# EasyEDA Pro project PicoDucky_V2.2.epro

# Schematic PicoDucky
Board Name: Board1; Create Date: 2026-04-21; Page Name: P1; Project Name: PicoDucky_V2.2(2mb); Schematic Name: PicoDucky; Update Date: 2026-04-21; Company: EasyEDA.com; Page Size: A4; Version: V1.0
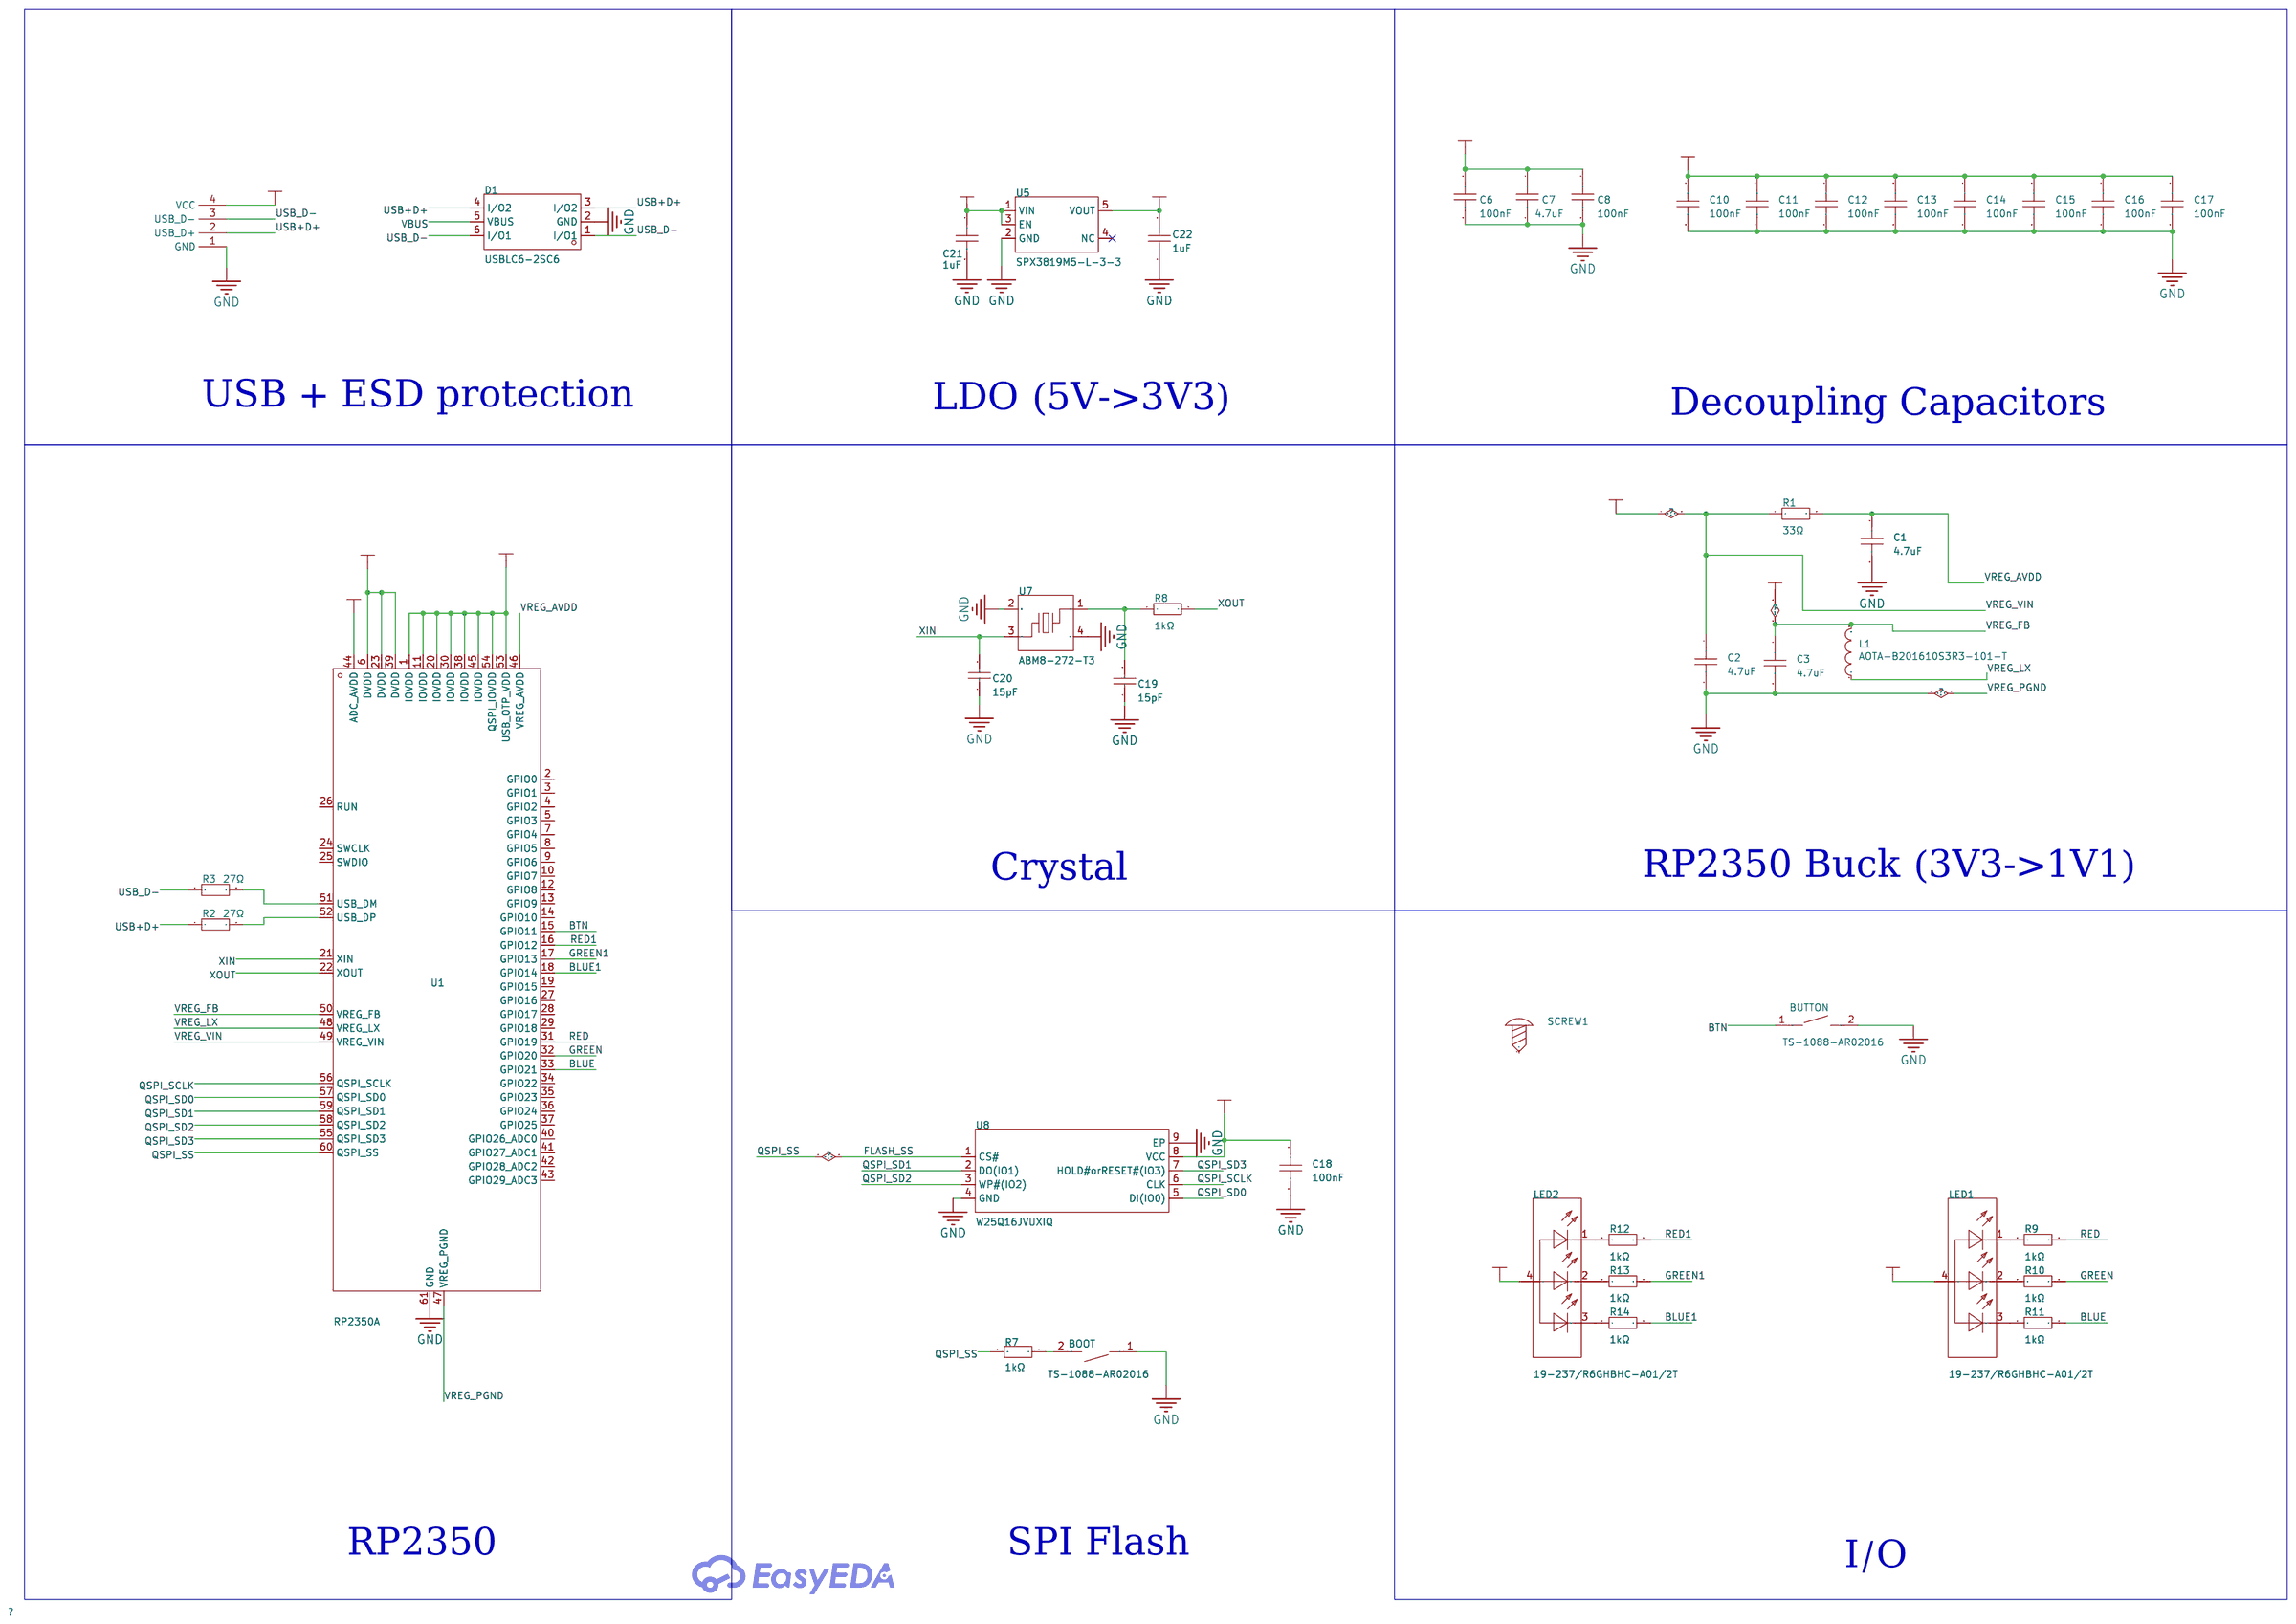
[diagram p0: schematic sheet]

## Parts
BOOT  TS-1088-AR02016  [SW-SMD_L3.9-W3.0-P4.45]
BUTTON  TS-1088-AR02016  [SW-SMD_L3.9-W3.0-P4.45]
C1  4.7uF  [C0402]
C2  4.7uF  [C0402]
C3  4.7uF  [C0402]
C6  100nF  [C0402]
C7  4.7uF  [C0402]
C8  100nF  [C0402]
C10  100nF  [C0402]
C11  100nF  [C0402]
C12  100nF  [C0402]
C13  100nF  [C0402]
C14  100nF  [C0402]
C15  100nF  [C0402]
C16  100nF  [C0402]
C17  100nF  [C0402]
C18  100nF  [C0402]
C19  15pF  [C0402]
C20  15pF  [C0402]
C21  1uF  [C0402]
C22  1uF  [C0402]
D1  USBLC6-2SC6  [SOT-23-6_L2.9-W1.6-P0.95-LS2.8-BL]
L1  AOTA-B201610S3R3-101-T  [IND-SMD_L2.0-W1.6_AOTA-B201610S3R3-101-T]
LED1  19-237/R6GHBHC-A01/2T  [LED-ARRAY-SMD_4P-L1.6-W1.6-BL_1]
LED2  19-237/R6GHBHC-A01/2T  [LED-ARRAY-SMD_4P-L1.6-W1.6-BL_1]
R1  33Ω  [R0402]
R2  27Ω  [R0402]
R3  27Ω  [R0402]
R7  1kΩ  [R0402]
R8  1kΩ  [R0402]
R9  1kΩ  [R0402]
R10  1kΩ  [R0402]
R11  1kΩ  [R0402]
R12  1kΩ  [R0402]
R13  1kΩ  [R0402]
R14  1kΩ  [R0402]
SCREW1  -  [Screw-Hole-M2]
U1  RP2350A  [QFN-60_L7.0-W7.0-P0.40-TL-EP3.4]
U5  SPX3819M5-L-3-3  [SOT-23-5_L3.0-W1.6-P0.95-LS2.8-BR]
U7  ABM8-272-T3  [CRYSTAL-SMD_4P-L3.2-W2.5-BL]
U8  W25Q16JVUXIQ  [USON-8_L3.0-W2.0-P0.50-BL-EP]
X1  -  [USBA_PCB]

## Library data of the parts
BOOT BUTTON = TS-1088-AR02016: Circuit:SPST Actuator Style:Round Button Operating Force:160gf Mounting Style:Brick nogging Switch Length:4mm Switch Width:3mm Switch Height:2mm Strike Gundam:不带 Contact Current:50mA Voltage Rating (DC):12V Insulation Resistance:100MΩ Actuator/Cap Color:B; LCSC Part Name: 4*3*2mm 立贴 轻触开关; Supplier Part: C720477; Manufacturer: XUNPU(讯普); Supplier Footprint: SMD; JLCPCB Part Class: Basic Part; Datasheet: https://atta.szlcsc.com/upload/public/pdf/source/20200810/C720475_60D09DD6C54279ADDB2DC25100F1CC11.pdf; Supplier: LCSC; Circuit: SPST; Actuator Style: Round Button; Operating Force: 160gf; Mounting Style: Brick nogging; Switch Length: 4mm; Switch Width: 3mm; Switch Height: 2mm; Strike Gundam: 不带; Contact Current: 50mA; Voltage Rating (DC): 12V; Insulation Resistance: 100MΩ; Actuator/Cap Color: Black; Pin Style: SMDSplicing; Mechanical Life: 10万次; Operating Temperature: -30℃~+80℃
C1-C3 C7 = CL05A475MP5NRNC: Capacitance: Tolerance:±20% Tolerance:±20% Voltage Rated: Temperature Coefficient:; LCSC Part Name: 4.7uF ±20% 10V; Supplier Part: C23733; Manufacturer: SAMSUNG(三星); Supplier Footprint: 0402; JLCPCB Part Class: Basic Part; Datasheet: https://atta.szlcsc.com/upload/public/pdf/source/20160218/1457707763339.pdf; Supplier: LCSC; Tolerance: ±20%
C6 C8 C10-C18 = CL05B104KO5NNNC: Capacitance: Tolerance:±10% Tolerance:±10% Voltage Rated: Temperature Coefficient:; LCSC Part Name: 100nF ±10% 16V; Supplier Part: C1525; Manufacturer: SAMSUNG(三星); Supplier Footprint: 0402; JLCPCB Part Class: Basic Part; Datasheet: https://atta.szlcsc.com/upload/public/pdf/source/20160218/1457707763339.pdf; Supplier: LCSC; Tolerance: ±10%
C19 C20 = 0402CG150J500NT: Capacitance: Tolerance:±5% Tolerance:±5% Voltage Rated: Temperature Coefficient:; LCSC Part Name: 15pF ±5% 50V; Supplier Part: C1548; Manufacturer: FH(风华); Supplier Footprint: 0402; JLCPCB Part Class: Basic Part; Datasheet: https://atta.szlcsc.com/upload/public/pdf/source/20200305/C486355_26A10D38EF8C2A5C37091D0039909270.pdf; Supplier: LCSC; Tolerance: ±5%
C21 C22 = CL05A105KA5NQNC: Capacitance: Tolerance:±10% Tolerance:±10% Voltage Rated: Temperature Coefficient:; LCSC Part Name: 1uF ±10% 25V; Supplier Part: C52923; Manufacturer: SAMSUNG(三星); Supplier Footprint: 0402; JLCPCB Part Class: Basic Part; Datasheet: https://atta.szlcsc.com/upload/public/pdf/source/20160218/1457707763339.pdf; Supplier: LCSC; Tolerance: ±10%
D1 = USBLC6-2SC6_C2687116: Maximum Clamping Voltage:15V Breakdown Voltage:6V Number of Lines:双路 Type:ESD; Supplier Part: C2687116; Manufacturer: UMW(友台半导体); Supplier Footprint: SOT-23-6; JLCPCB Part Class: Extended Part; Datasheet: https://atta.szlcsc.com/upload/public/pdf/source/20231109/512642D850D9873E7C519F71E85B9A10.pdf; Supplier: LCSC; Maximum Clamping Voltage: 15V; Breakdown Voltage: 6V; Number of Lines: 双路; Type: ESD
L1 = AOTA-B201610S3R3-101-T: Supplier Part: C42411119; Manufacturer: ABRACON; Supplier Footprint: 0806; JLCPCB Part Class: Extended Part; Datasheet: https://atta.szlcsc.com/upload/public/pdf/source/20241210/8ED7235334351200B2CE75E3CBC0DAAD.pdf; Supplier: LCSC
LED1 LED2 = 19-237/R6GHBHC-A01/2T: Diode Configuration:Common Anode Viewing Angle:120° Lens Color:Water Clear; Supplier Part: C60105; Manufacturer: EVERLIGHT(亿光); Supplier Footprint: SMD-4P,1.6x1.6mm; JLCPCB Part Class: Extended Part; Supplier: LCSC; Diode Configuration: Common Anode; Viewing Angle: 120°; Lens Color: Water Clear
R1 = 0402WGF330JTCE: Type:Thick Film Resistors Resistance:33Ω Tolerance:±1% Tolerance:±1% Power(Watts): Overload Voltage (Max): Temperature Coefficient:±100ppm/℃ Temperature Coefficient:±100ppm/℃ Operating Temperature Range:-55℃~+155℃ Operating Temperature Range:-55℃~+155℃; LCSC Part Name: 33Ω ±1% 62.5mW 厚膜电阻; Supplier Part: C25105; Manufacturer: UNI-ROYAL(厚声); Supplier Footprint: 0402; JLCPCB Part Class: Basic Part; Datasheet: https://atta.szlcsc.com/upload/public/pdf/source/20200306/C422600_1E6D84923E4A46A82E41ADD87F860B5C.pdf; Supplier: LCSC; Type: Thick Film Resistors; Tolerance: ±1%; Temperature Coefficient: ±100ppm/℃; Operating Temperature Range: -55℃~+155℃
R2 R3 = 0402WGF270JTCE: Type:Thick Film Resistor Resistance:27Ω Tolerance:±1% Tolerance:±1% Power(Watts):62.5mW Voltage-Supply(Max):50V Temperature Coefficient:±100ppm/℃ Temperature Coefficient:±100ppm/℃ Operating Temperature:-55℃~+155℃ Operating Temperature:-55℃~+155℃; LCSC Part Name: 27Ω ±1% 62.5mW 厚膜电阻; Supplier Part: C25100; Manufacturer: UNI-ROYAL(厚声); Supplier Footprint: 0402; JLCPCB Part Class: Extended Part; Datasheet: https://item.szlcsc.com/datasheet/0402WGF270JTCE/25843.html; Supplier: LCSC; Type: Thick Film Resistor; Tolerance: ±1%; Power(Watts): 62.5mW; Voltage-Supply(Max): 50V; Temperature Coefficient: ±100ppm/℃; Operating Temperature: -55℃~+155℃
R7-R14 = 0402WGF1001TCE: Type:Thick Film Resistors Resistance:1kΩ Tolerance:±1% Tolerance:±1% Power(Watts): Overload Voltage (Max): Temperature Coefficient:±100ppm/℃ Temperature Coefficient:±100ppm/℃ Operating Temperature Range:-55℃~+155℃ Operating Temperature Range:-55℃~+155℃; LCSC Part Name: 1kΩ ±1% 62.5mW 厚膜电阻; Supplier Part: C11702; Manufacturer: UNI-ROYAL(厚声); Supplier Footprint: 0402; JLCPCB Part Class: Basic Part; Datasheet: https://atta.szlcsc.com/upload/public/pdf/source/20200306/C422600_1E6D84923E4A46A82E41ADD87F860B5C.pdf; Supplier: LCSC; Type: Thick Film Resistors; Tolerance: ±1%; Temperature Coefficient: ±100ppm/℃; Operating Temperature Range: -55℃~+155℃
SCREW1 = Screw-Hole-M2: Supplier Footprint: 插件
U1 = RP2350A_C42411118: Supplier Part: C42411118; Manufacturer: Raspberry Pi(树莓派); Supplier Footprint: QFN-60-EP(7x7); JLCPCB Part Class: Extended Part; Datasheet: https://atta.szlcsc.com/upload/public/pdf/source/20241210/0989AB86AAD7A21936E5CD12ADC9EA29.pdf; Supplier: LCSC
U5 = SPX3819M5-L-3-3: Output Type:Fixed Voltage - Supply:20V Output Voltage:3.3V Output Voltage:3.3V Output Current:500mA Power Supply Rejection Ratio (PSRR):70dB@(1kHz) Operating Temperature:-40℃~+125℃@(Tj) Operating Temperature:-40℃~+125℃@(Tj) Output Configuration:Positive e; LCSC Part Name: 线性稳压器(LDO); Supplier Part: C20617301; Manufacturer: TECH PUBLIC(台舟); Supplier Footprint: SOT-23-5; JLCPCB Part Class: Extended Part; Datasheet: https://atta.szlcsc.com/upload/public/pdf/source/20240202/40226DC468208A402337870601A95599.pdf; Supplier: LCSC; Output Type: Fixed; Voltage - Supply: 20V; Output Voltage: 3.3V; Output Current: 500mA; Power Supply Rejection Ratio (PSRR): 70dB@(1kHz); Operating Temperature: -40℃~+125℃@(Tj); Output Configuration: Positive electrode; Number of Outputs: 1
U7 = ABM8-272-T3_C20625731: Supplier Part: C20625731; Manufacturer: ABRACON; Supplier Footprint: SMD3225-4P; JLCPCB Part Class: Extended Part; Datasheet: https://atta.szlcsc.com/upload/public/pdf/source/20240227/A8BE43F636D80F75C9AF5C59EDF21E9A.pdf; Supplier: LCSC
U8 = W25Q16JVUXIQ: Interface:SPI Memory Size:16Mbit Clock Frequency:133MHz Voltage - Supply:2.7V~3.6V Voltage - Supply:2.7V~3.6V Standby Supply Current:10uA Program / Erase Cycles:100,000 cycles Page Programming Time (Tpp):3ms Data Retention - TDR (Year):20 Years Operating; LCSC Part Name: 支持双/四路SPI接口的3V、16Mbit 串行闪存; Supplier Part: C2843335; Manufacturer: Winbond(华邦); Supplier Footprint: USON-8-EP(2x3); Datasheet: https://item.szlcsc.com/datasheet/W25Q16JVUXIQ/3030519.html; Supplier: LCSC; Interface: SPI; Memory Size: 16Mbit; Clock Frequency: 133MHz; Voltage - Supply: 2.7V~3.6V; Standby Supply Current: 10uA; Program / Erase Cycles: 100,000 cycles; Page Programming Time (Tpp): 3ms; Data Retention - TDR (Year): 20 Years; Operating Temperature: -40℃~+85℃
X1 = USBA_PCB: USB-A PCB

## Nets
1V1: C3.1 C6.1 C7.1 C8.1 L1.2 U1.6(DVDD) U1.23(DVDD) U1.39(DVDD) U1.50(VREG_FB)
3V3: C2.1 C10.1 C11.1 C12.1 C13.1 C14.1 C15.1 C16.1 C17.1 C18.1 C22.2 LED1.4(+) LED2.4(+) R1.1 U1.1(IOVDD) U1.11(IOVDD) U1.20(IOVDD) U1.30(IOVDD) U1.38(IOVDD) U1.44(ADC_AVDD) U1.45(IOVDD) U1.49(VREG_VIN) U1.53(USB_OTP_VDD) U1.54(QSPI_IOVDD) U5.5(VOUT) U8.8(VCC)
GND: BOOT.1 BUTTON.2 C1.2 C2.2 C3.2 C6.2 C7.2 C8.2 C10.2 C11.2 C12.2 C13.2 C14.2 C15.2 C16.2 C17.2 C18.2 C19.1 C20.1 C21.2 C22.1 D1.2(GND) U1.47(VREG_PGND) U1.61(GND) U5.2(GND) U7.2(GND) U7.4(GND) U8.4(GND) U8.9(EP) X1.1(GND)
VBUS: C21.1 D1.5(VBUS) U5.1(VIN) U5.3(EN) X1.4(VCC)
BLUE: R11.2 U1.33(GPIO21)
BLUE1: R14.2 U1.18(GPIO14)
BTN: BUTTON.1 U1.15(GPIO11)
FLASH_SS: R7.2 U1.60(QSPI_SS) U8.1(CS#)
GREEN: R10.2 U1.32(GPIO20)
GREEN1: R13.2 U1.17(GPIO13)
QSPI_SCLK: U1.56(QSPI_SCLK) U8.6(CLK)
QSPI_SD0: U1.57(QSPI_SD0) U8.5(DI(IO0))
QSPI_SD1: U1.59(QSPI_SD1) U8.2(DO(IO1))
QSPI_SD2: U1.58(QSPI_SD2) U8.3(WP#(IO2))
QSPI_SD3: U1.55(QSPI_SD3) U8.7(HOLD#orRESET#(IO3))
RED: R9.2 U1.31(GPIO19)
RED1: R12.2 U1.16(GPIO12)
USB+D+: D1.3(I/O2) D1.4(I/O2) R2.1 X1.2(USB_D+)
USB_D-: D1.1(I/O1) D1.6(I/O1) R3.1 X1.3(USB_D-)
VREG_AVDD: C1.1 R1.2 U1.46(VREG_AVDD)
VREG_LX: L1.1 U1.48(VREG_LX)
XIN: C20.2 U1.21(XIN) U7.3
XOUT: R8.2 U1.22(XOUT)
$1N5845: R2.2 U1.52(USB_DP)
$1N5851: R3.2 U1.51(USB_DM)
$1N6376: BOOT.2 R7.1
$1N20394: LED1.1(R-) R9.1
$1N20433: LED1.2(G-) R10.1
$1N20472: LED1.3(B-) R11.1
$1N22177: C19.2 R8.1 U7.1
$1N30970: LED2.3(B-) R14.1
$1N30972: LED2.2(G-) R13.1
$1N30974: LED2.1(R-) R12.1

Not connected (* = marked no-connect by the designer): SCREW1 1; U1 2(GPIO0) 3(GPIO1) 4(GPIO2) 5(GPIO3) 7(GPIO4) 8(GPIO5) 9(GPIO6) 10(GPIO7) 12(GPIO8) 13(GPIO9) 14(GPIO10) 19(GPIO15) 24(SWCLK) 25(SWDIO) 26(RUN) 27(GPIO16) 28(GPIO17) 29(GPIO18) 34(GPIO22) 35(GPIO23) 36(GPIO24) 37(GPIO25) 40(GPIO26_ADC0) 41(GPIO27_ADC1) 42(GPIO28_ADC2) 43(GPIO29_ADC3); U5 4(NC)*

## Notes on the sheet
- USB + ESD protection
- LDO (5V->3V3)
- Decoupling Capacitors
- Crystal
- RP2350 Buck (3V3->1V1)
- RP2350
- SPI Flash
- I/O

# Board PCB1
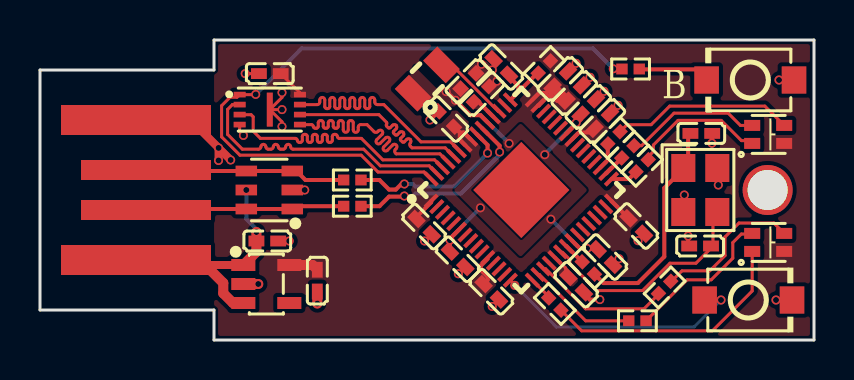
[diagram p1: board, top side]
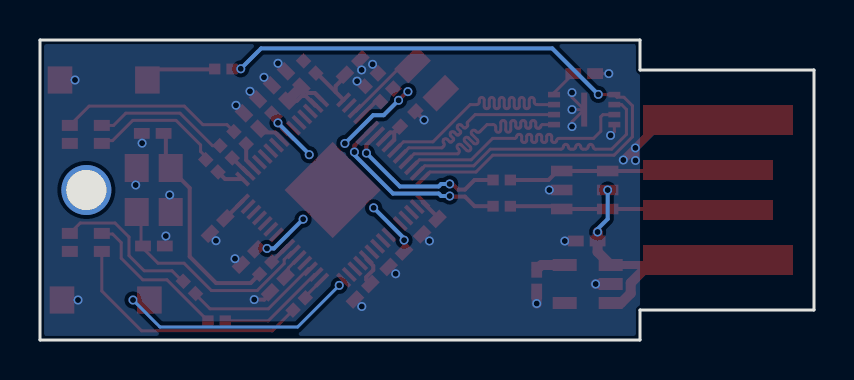
[diagram p2: board, bottom side, seen from below]

Outline 38.7 x 15 mm; copper layers: Top Layer, Bottom Layer. Coordinates in mm from the lower left corner of the outline.
Outline path: 0,13.5 0,1.5 8.7,1.5 8.7,0 38.7,0 38.7,15 8.7,15 8.7,13.5 0,13.5
Stack: Top Layer 0.035mm / Dielectric1 1.51mm FR4 er 4.5 / Bottom Layer 0.035mm

## Design rules (mm)
net USB_D-: DP1
net USB+D+: DP1
net $1N5845: DP2
net $1N5851: DP2
template: Custom Config
spacing copperThickness1oz (default): track to track 0.15, other pairs 0.152 to 0.3
spacing copperThickness2oz: track to track 0.203, other pairs 0.152 to 0.3
track width copperThickness1oz (default): min 0.1, default 0.2, max 2.54
track width copperThickness2oz: min 0.203, default 0.254, max 2.54
differential pair differentialPair (default): width min 0.127, default 0.254, max 2.54; gap min 0.152, default 0.152
via viaSize (default): diameter min 0.4, default 0.45, max 10; hole min 0.3, default 0.3, max 6.3

## Placement (name value [footprint] x y rotation side)
BOOT  TS-1088-AR02016  [SW-SMD_L3.9-W3.0-P4.45]  35.52 13 180 top
BUTTON  TS-1088-AR02016  [SW-SMD_L3.9-W3.0-P4.45]  35.42 2 0 top
C1  4.7uF  [C0402#2]  23.07 13.65 135 top
C2  4.7uF  [C0402]  22.07 12.3 45 top
C3  4.7uF  [C0402#3]  21.42 12.95 45 top
C6  100nF  [C0402#2]  20.88 4.04 315 top
C7  4.7uF  [C0402#2]  28.27 4.15 315 top
C8  100nF  [C0402#2]  27.42 11.65 45 top
C10  100nF  [C0402#2]  26.02 13.05 45 top
C11  100nF  [C0402#2]  26.72 12.35 45 top
C12  100nF  [C0402#2]  28.12 10.95 45 top
C13  100nF  [C0402#2]  29.82 5.7 315 top
C14  100nF  [C0402#2]  26.81 2.77 315 top
C15  100nF  [C0402#2]  22.57 2.41 315 top
C16  100nF  [C0402#2]  19.21 5.67 315 top
C17  100nF  [C0402#4]  20.32 11.05 135 top
C18  100nF  [C0402#2]  11.49 13.32 180 top
C19  15pF  [C0402#2]  33.07 10.33 180 top
C20  15pF  [C0402#2]  33.01 4.7 0 top
C21  1uF  [C0402#2]  11.37 4.95 0 top
C22  1uF  [C0402#2]  13.87 2.97 90 top
D1  USBLC6-2SC6  [SOT-23-6_L2.9-W1.6-P0.95-LS2.8-BL]  11.47 7.5 90 top
L1  AOTA-B201610S3R3-101-T  [IND-SMD_L2.0-W1.6_AOTA-B201610S3R3-101-T]  19.37 13.05 225 top
LED1  19-237/R6GHBHC-A01/2T  [LED-ARRAY-SMD_4P-L1.6-W1.6-BL_1]  36.41 10.28 0 top
LED2  19-237/R6GHBHC-A01/2T  [LED-ARRAY-SMD_4P-L1.6-W1.6-BL_1]  36.41 4.88 0 top
R1  33Ω  [R0402]  25.22 13.65 225 top
R2  27Ω  [R0402]  15.62 8 0 top
R3  27Ω  [R0402]  15.62 6.69 0 top
R7  1kΩ  [R0402]  29.53 13.55 180 top
R8  1kΩ  [R0402]  27.42 3.6 135 top
R9  1kΩ  [R0402]  30.11 8.71 225 top
R10  1kΩ  [R0402]  29.4 9.41 225 top
R11  1kΩ  [R0402]  28.7 10.11 225 top
R12  1kΩ  [R0402]  25.74 1.8 135 top
R13  1kΩ  [R0402]  29.87 0.96 180 top
R14  1kΩ  [R0402]  31.23 2.63 225 top
SCREW1  -  [Screw-Hole-M2]  36.38 7.5 0 top
U1  RP2350A  [QFN-60_L7.0-W7.0-P0.40-TL-EP3.4]  24.07 7.5 45 top
U5  SPX3819M5-L-3-3  [SOT-23-5_L3.0-W1.6-P0.95-LS2.8-BR]  11.32 2.8 180 top
U7  ABM8-272-T3  [CRYSTAL-SMD_4P-L3.2-W2.5-BL]  33.02 7.5 270 top
U8  W25Q16JVUXIQ  [USON-8_L3.0-W2.0-P0.50-BL-EP]  11.49 11.52 270 top
X1  -  [USBA_PCB]  -0.08 13.85 0 top

## Footprints (pads in the part's own frame, mm; a bottom-side part is the same pattern mirrored in y, then rotated)
C0402
  rect 0.6x0.54 smd: 1(-0.545,0) 2(0.545,0)
C0402#2
  rect 0.79x0.54 smd: 1(-0.545,0) 2(0.545,0)
C0402#3
  rect 0.6x0.6 smd: 1(-0.545,0) 2(0.545,0)
C0402#4
  rect 0.64x0.54 smd: 1(-0.545,0) 2(0.545,0)
CRYSTAL-SMD_4P-L3.2-W2.5-BL
  rect 1.4x1.2 smd: 1(-1.1,-0.85) 2(1.1,-0.85) 3(1.1,0.85) 4(-1.1,0.85)
IND-SMD_L2.0-W1.6_AOTA-B201610S3R3-101-T
  rect 1x1.6 smd: 1(-1,0) 2(1,0)
LED-ARRAY-SMD_4P-L1.6-W1.6-BL_1
  rect 0.8x0.55 smd: 1(-0.8,-0.45) 2(-0.8,0.45) 3(0.8,0.45) 4(0.8,-0.45)
QFN-60_L7.0-W7.0-P0.40-TL-EP3.4
  rect 0.875x0.2 smd: 1(-3.575,2.8) 2(-3.575,2.4) 3(-3.575,2) 4(-3.575,1.6) 5(-3.575,1.2) 6(-3.575,0.8) 7(-3.575,0.4) 8(-3.575,0) 9(-3.575,-0.4) 10(-3.575,-0.8) 11(-3.575,-1.2) 12(-3.575,-1.6) 13(-3.575,-2) 14(-3.575,-2.4) 15(-3.575,-2.8) 31(3.575,-2.8) 32(3.575,-2.4) 33(3.575,-2.001) 34(3.575,-1.6) 35(3.575,-1.2) 36(3.575,-0.8) 37(3.575,-0.4) 38(3.575,-0.001) 39(3.575,0.4) 40(3.575,0.8) 41(3.575,1.2) 42(3.575,1.6) 43(3.575,2) 44(3.575,2.4) 45(3.575,2.8)
  rect 0.2x0.875 smd: 16(-2.8,-3.575) 17(-2.4,-3.575) 18(-2,-3.575) 19(-1.6,-3.575) 20(-1.2,-3.575) 21(-0.8,-3.575) 22(-0.4,-3.575) 23(0,-3.575) 24(0.4,-3.575) 25(0.8,-3.575) 26(1.2,-3.575) 27(1.6,-3.575) 28(2,-3.575) 29(2.4,-3.575) 30(2.8,-3.575) 46(2.8,3.575) 47(2.4,3.575) 48(2,3.575) 49(1.6,3.575) 50(1.2,3.575) 51(0.8,3.575) 52(0.4,3.575) 53(0,3.575) 54(-0.4,3.575) 55(-0.8,3.575) 56(-1.2,3.575) 57(-1.6,3.575) 58(-2,3.575) 59(-2.4,3.575) 60(-2.8,3.575)
  rect 3.4x3.4 smd: 61(0,0)
R0402
  rect 0.566x0.54 smd: 1(-0.433,0) 2(0.433,0)
Screw-Hole-M2
  round 2.5 hole 2: 1(0,0)
SOT-23-5_L3.0-W1.6-P0.95-LS2.8-BR
  rect 1.2x0.6 smd: 1(1.15,-0.95) 2(1.15,0) 3(1.15,0.95) 4(-1.15,0.95) 5(-1.15,-0.95)
SOT-23-6_L2.9-W1.6-P0.95-LS2.8-BL
  rect 0.532x1.072 smd: 1(-0.95,-1.149) 2(0,-1.149) 3(0.95,-1.149) 4(0.95,1.149) 5(0,1.149) 6(-0.95,1.149)
SW-SMD_L3.9-W3.0-P4.45
  rect 1.23x1.36 smd: 1(-2.185,0) 2(2.185,0)
USBA_PCB
  rect 7.5x1.5 smd: 1(4.88,-2.85) 4(4.88,-9.85)
  rect 6.5x1 smd: 2(5.38,-5.35) 3(5.38,-7.35)
USON-8_L3.0-W2.0-P0.50-BL-EP
  rect 0.28x0.6 smd: 1(-0.75,-1.508) 2(-0.25,-1.508) 3(0.25,-1.508) 4(0.75,-1.508) 5(0.75,1.508) 6(0.25,1.508) 7(-0.25,1.508) 8(-0.75,1.508)
  rect 1.7x0.3 smd: 9(0,0)

## Nets
As in the schematic.

Pads without a net: SCREW1 1; U1 2 3 4 5 7 8 9 10 12 13 14 19 24 25 26 27 28 29 34 35 36 37 40 41 42 43; U5 4

## Via types
v1: diameter 0.45, hole 0.3, Top Layer to Bottom Layer, 51 vias

## Routing (per net, layer and track width the routed paths; a pad name or vN(x,y) marks a point on that pad's centre or on a via; arc(x,y) is an arc through that point)
1V1: length 17.2
  Top Layer w0.201: U1.23 26.99,4.58 v1(27.35,4.58) 27.84,4.58 C7.1 ; v1(20.3,12.42) 20.34,12.42 v1(20.77,11.98) 21.52,11.24 22.02,11.24 U1.50 ; 20.5,4.42 20.5,5.06 U1.6 ; C8.1 27.03,11.03 26.31,10.31
  Bottom Layer w0.201: v1(26.8,10.86) 25.24,9.29 v1(25.24,9.26) ; v1(23.46,9.83) 22.04,11.24 21.52,11.24 v1(20.77,11.98) ; v1(25.54,6.04) 27.01,4.58 v1(27.35,4.58) ; v1(20.5,4.99) 20.5,5.09 v1(22.02,6.61)
3V3: length 16.8
  Top Layer w0.15: C14.1 26.28,3.3 26.28,3.6 25.76,4.12 U1.20 ; 12.04,13.32 13,12.36 U8.8
  Top Layer w0.2: U1.1 19.56,6.88 18.82,6.15 C16.1 ; 22.18,2.8 22.39,3 22.39,3.15 22.04,3.5 22.04,3.71 22.39,4.06
  Top Layer w0.201: C11.1 25.85,11.96 25.62,12.2 25.42,12.2 24.94,11.72 U1.44 ; C12.1 27.54,10.38 26.94,10.38 U1.38 ; C2.1 21.91,11.91 U1.49 ; U1.53 21.19,10.38 20.99,10.38 ; C10.1 25.32,12.35 24.96,12.35 U1.45 ; C13.1 28.57,6.94 U1.30 ; 20.99,10.38 20.99,10.01 21.26,9.74 ; 20.99,10.38 C17.1
  Top Layer w0.5: C11.1 C10.1 ; U5.5 13.63,3.75 C22.2
GND: length 23.6
  Top Layer w0.15: v1(12.1,12.37) 12.1,12.13 U8.9 ; U8.4 9.98,10.42 v1(10.17,10.23) ; U8.9 12.1,10.91 v1(12.1,10.67) ; U8.9 v1(12.1,11.52) ; v1(10.26,13.32) C18.2
  Top Layer w0.2: C6.2 20.93,3.31 v1(20.92,3.31) ; v1(19.23,4.95) 19.26,4.95 19.59,5.28 ; C15.2 22.95,2.02 v1(22.61,1.68)
  Top Layer w0.201: v1(28.2,12.44) C8.2 ; v1(36.8,2) BUTTON.2 ; v1(36.95,13) BOOT.1 ; 28.65,3.76 v1(28.95,4.06) ; C13.2 30.2,5.26 v1(29.9,4.96) ; 33.5,10.42 33.6,10.32 v1(33.6,9.84) ; v1(27.5,13.14) C11.2 ; 12.61,7.5 v1(13.23,7.5) ; 11.91,4.95 v1(12.46,4.95) ; v1(32.22,7.25) 32.22,6.4 ; v1(33.92,7.75) 33.92,8.6 ; v1(26.8,13.84) C10.2 ; C17.2 v1(19.5,11) ; v1(32.41,5.2) 32.41,4.75 ; v1(27.99,2.02) 27.49,2.02 27,2.51 ; v1(28.9,11.74) C12.2
  Top Layer w0.399: X1.1 7.53,11 v1(8.93,9.6) ; v1(8.93,9.6) 8.93,8.98 v1(8.93,8.98) ; v1(8.93,9.6) v1(9.53,9)
  Top Layer w0.5: U5.2 v1(10.92,2.8) ; C22.1 v1(13.87,1.82)
  vias: v1(22.07,13.79) v1(22.62,13.5) v1(22.85,12.94)
VBUS: length 12.7
  Top Layer w0.399: 8.27,3.75 U5.1
  Top Layer w0.5: U5.3 9.65,1.85 9.16,2.33 9.16,2.85 8.27,3.75 8.02,4 X1.4 ; v1(10.82,5.4) C21.1 10.82,4.41 U5.1
  Bottom Layer w0.201: v1(10.82,5.4) 10.82,5.54 10.32,6.05 v1(10.32,7.5)
BLUE: length 1.3
  Top Layer w0.2: U1.33 28.39,8.99 R11.2
BLUE1: length 6.9
  Top Layer w0.15: U1.18 25.28,3.56 27.28,1.56 30.2,1.56 30.94,2.3
BTN: length 12.9
  Top Layer w0.15: U1.15 23.74,2.77 v1(23.74,2.73) ; BUTTON.1 v1(34.05,2)
  Bottom Layer w0.15: v1(23.74,2.73) 25.82,0.65 32.7,0.65 v1(34.05,2)
FLASH_SS: length 34.5
  Top Layer w0.15: v1(10.79,12.28) 10.78,12.27 U8.1 9.85,12.14 9.5,12.14 9.08,11.71 9.08,10.16 10,9.24 16.06,9.24 16.9,8.4 19.21,8.4 U1.60
  Top Layer w0.299: v1(28.66,13.56) 28.67,13.55 29.1,13.55
  Bottom Layer w0.201: v1(10.79,12.28) 13.09,14.58 27.64,14.58 v1(28.66,13.56)
GREEN: length 1.1
  Top Layer w0.2: 28.29,8.33 28.32,8.33 R10.2
GREEN1: length 5.5
  Top Layer w0.15: U1.17 24.97,3.27 27.28,0.96 R13.2
QSPI_SCLK: length 10.2
  Top Layer w0.15: U8.6 16.94,11.27 17.33,10.88 arc(17.35,10.84) 17.33,10.79 arc(17.31,10.74) 17.33,10.7 17.41,10.61 arc(17.46,10.59) 17.51,10.61 17.63,10.74 arc(17.71,10.77) 17.8,10.74 17.81,10.73 arc(17.84,10.64) 17.81,10.56 17.68,10.44 arc(17.66,10.39) 17.68,10.34 17.77,10.26 arc(17.81,10.24) 17.86,10.26 17.99,10.39 arc(18.07,10.42) 18.15,10.39 18.16,10.37 arc(18.2,10.29) 18.16,10.21 18.04,10.08 arc(18.02,10.04) 18.04,9.99 18.12,9.91 arc(18.17,9.89) 18.21,9.91 18.34,10.03 arc(18.42,10.07) 18.5,10.03 18.52,10.02 arc(18.55,9.94) 18.52,9.86 arc(18.48,9.77) 18.52,9.69 18.6,9.61 20.26,9.61 U1.56
QSPI_SD0: length 14
  Top Layer w0.15: U1.57 20,9.31 17.81,9.31 17.77,9.35 arc(17.73,9.44) 17.77,9.53 17.81,9.58 arc(17.81,9.75) 17.64,9.75 17.37,9.48 arc(17.19,9.48) 17.19,9.66 17.46,9.93 arc(17.46,10.11) 17.28,10.11 17.01,9.84 arc(16.84,9.84) 16.84,10.01 17.11,10.28 arc(17.11,10.46) 16.93,10.46 16.88,10.41 arc(16.79,10.38) 16.71,10.41 16.35,10.77 16.04,10.77 arc(15.95,10.73) 15.91,10.64 15.91,10.5 arc(15.79,10.38) 15.66,10.5 15.66,10.87 arc(15.63,10.94) 15.56,10.97 15.51,10.97 arc(15.44,10.94) 15.41,10.87 15.41,10.51 arc(15.29,10.38) 15.16,10.51 15.16,10.87 arc(15.13,10.94) 15.06,10.97 15.01,10.97 arc(14.94,10.94) 14.91,10.87 14.91,10.68 arc(14.89,10.62) 14.82,10.59 14.75,10.59 arc(14.69,10.62) 14.66,10.68 14.66,10.87 arc(14.63,10.94) 14.56,10.97 14.51,10.97 arc(14.44,10.94) 14.41,10.87 14.41,10.68 arc(14.39,10.62) 14.32,10.59 14.25,10.59 arc(14.19,10.62) 14.16,10.68 14.16,10.87 arc(14.13,10.94) 14.06,10.97 14.01,10.97 arc(13.94,10.94) 13.91,10.87 13.91,10.68 arc(13.89,10.62) 13.82,10.59 13.75,10.59 arc(13.69,10.62) 13.66,10.68 arc(13.64,10.74) 13.57,10.77 U8.5
QSPI_SD1: length 14
  Top Layer w0.15: U8.2 9.62,11.77 9.38,11.53 9.38,10.28 10.12,9.54 10.92,9.54 arc(11.01,9.58) 11.04,9.66 arc(11.08,9.74) 11.16,9.78 11.17,9.78 arc(11.26,9.74) 11.29,9.66 arc(11.33,9.58) 11.41,9.54 11.54,9.54 arc(11.63,9.58) 11.66,9.66 arc(11.7,9.74) 11.78,9.78 11.79,9.78 arc(11.88,9.74) 11.91,9.66 arc(11.95,9.58) 12.03,9.54 12.16,9.54 arc(12.25,9.58) 12.28,9.66 arc(12.32,9.74) 12.4,9.78 12.41,9.78 arc(12.5,9.74) 12.53,9.66 arc(12.57,9.58) 12.65,9.54 16.18,9.54 17.02,8.71 19.46,8.71 19.84,8.33
QSPI_SD2: length 14.1
  Top Layer w0.15: U1.58 19.73,9.01 17.14,9.01 16.07,10.08 14.97,10.08 arc(14.9,10.11) 14.87,10.18 arc(14.84,10.25) 14.77,10.28 14.72,10.28 arc(14.65,10.25) 14.62,10.18 14.62,9.98 arc(14.59,9.91) 14.52,9.88 14.47,9.88 arc(14.4,9.91) 14.37,9.98 14.37,10.18 arc(14.34,10.25) 14.27,10.28 14.22,10.28 arc(14.15,10.25) 14.12,10.18 14.12,9.98 arc(14.09,9.91) 14.02,9.88 13.97,9.88 arc(13.9,9.91) 13.87,9.98 13.87,10.18 arc(13.84,10.25) 13.77,10.28 13.72,10.28 arc(13.65,10.25) 13.62,10.18 13.62,9.98 arc(13.59,9.91) 13.52,9.88 13.47,9.88 arc(13.4,9.91) 13.37,9.98 13.37,10.18 arc(13.34,10.25) 13.27,10.28 13.22,10.28 arc(13.15,10.25) 13.12,10.18 13.12,9.98 arc(13.09,9.91) 13.02,9.88 12.97,9.88 arc(12.9,9.91) 12.87,9.98 arc(12.84,10.05) 12.77,10.08 11.02,10.08 10.66,10.44 10.66,11.16 10.55,11.27 9.99,11.27 U8.3
QSPI_SD3: length 14.1
  Top Layer w0.15: U8.7 13.86,11.77 arc(13.95,11.81) 13.99,11.89 13.99,12 arc(14.11,12.13) 14.24,12 14.24,11.67 arc(14.27,11.6) 14.34,11.57 14.39,11.57 arc(14.46,11.6) 14.49,11.67 14.49,12 arc(14.61,12.13) 14.74,12 14.74,11.67 arc(14.77,11.6) 14.84,11.57 14.89,11.57 arc(14.96,11.6) 14.99,11.67 14.99,12 arc(15.11,12.13) 15.24,12 15.24,11.67 arc(15.27,11.6) 15.34,11.57 15.39,11.57 arc(15.46,11.6) 15.49,11.67 15.49,12 arc(15.61,12.13) 15.74,12 15.74,11.67 arc(15.77,11.6) 15.84,11.57 15.89,11.57 arc(15.96,11.6) 15.99,11.67 15.99,12 arc(16.11,12.13) 16.24,12 16.24,11.67 arc(16.27,11.6) 16.34,11.57 16.39,11.57 arc(16.46,11.6) 16.49,11.67 16.49,12 arc(16.61,12.13) 16.74,12 16.74,11.89 arc(16.78,11.81) 16.86,11.77 17.19,11.77 19.05,9.91 20.53,9.91 U1.55
RED: length 1.4
  Top Layer w0.2: U1.31 29.44,8.05 R9.2
RED1: length 1.2
  Top Layer w0.15: R12.2 25.43,2.17 U1.16
USB+D+: length 10.1
  Top Layer w0.201: X1.2 5.35,8.45 D1.4 12.82,8.45 13.27,8 15.18,8
USB_D-: length 10
  Top Layer w0.201: 15.18,6.69 13.1,6.69 12.96,6.55 D1.6 5.35,6.55 X1.3
VREG_AVDD: length 3
  Top Layer w0.201: 23.92,12.4 23.52,12.01 U1.46 ; 23.92,12.4 24.86,13.34 R1.2 ; 23.92,12.4 23.92,12.7 23.4,13.21
VREG_LX: length 3.9
  Top Layer w0.15: 20.07,13.76 20.12,13.76 20.25,13.88 20.46,13.88 22.9,11.44 U1.48
XIN: length 11
  Top Layer w0.15: 33.65,6.34 33.65,4.69 32.8,3.84 31.5,3.84 30.13,2.47 27.84,2.47 26.49,3.82 26.49,4.02 26.13,4.39
XOUT: length 1.1
  Top Layer w0.201: U1.22 26.33,4.69 R8.2
$1N5845: length 8.6
  Top Layer w0.201: U1.52 22.38,9.75 v1(22.38,9.35) ; R2.2 16.97,8 17.45,7.52 17.79,7.52 18.07,7.8 v1(18.22,7.8)
  Bottom Layer w0.201: v1(22.38,9.35) 20.71,7.68 18.77,7.68 18.64,7.8 v1(18.22,7.8)
$1N5851: length 9.7
  Top Layer w0.201: v1(18.22,7.2) 18.19,7.17 17.45,7.17 16.97,6.69 R3.2 ; U1.51 22.98,9.72 v1(22.98,9.4)
  Bottom Layer w0.201: v1(22.98,9.4) 22.98,9.25 21.05,7.32 18.77,7.32 18.64,7.2 v1(18.22,7.2)
$1N6376: length 3.6
  Top Layer w0.201: R7.1 29.98,13.53 32.8,13.53 BOOT.2
$1N20394: length 6.8
  Top Layer w0.15: LED1.1 35.47,9.97 35.07,9.97 34.06,10.98 31.9,10.98 30.67,9.75 30.67,9.42 30.41,9.17 R9.1
$1N20433: length 6.8
  Top Layer w0.15: LED1.2 35.02,10.73 34.41,11.34 31.7,11.34 30.08,9.72 R10.1
$1N20472: length 9.1
  Top Layer w0.15: 37.21,10.73 36.24,11.69 31.48,11.69 30.56,10.77 29.35,10.77 R11.1
$1N22177: length 11
  Top Layer w0.201: R8.1 28.17,2.85 29.89,2.85 31.22,4.17 31.22,7.6 32.41,8.79 32.41,10.42
$1N30970: length 7.6
  Top Layer w0.15: 37.21,5.33 36.69,5.85 34.95,5.85 34.25,5.15 34.25,4.22 33.49,3.46 32.1,3.46 31.56,2.92
$1N30972: length 7.6
  Top Layer w0.15: LED2.2 35.58,5.3 35.07,5.3 34.64,4.87 34.64,4.09 33.56,3.01 32.35,3.01 30.3,0.96
$1N30974: length 12.8
  Top Layer w0.15: LED2.1 35.61,2.45 33.62,0.46 27.08,0.46 26.1,1.44 26.1,1.54

## Copper pours and planes (outline as drawn; the poured copper is in the pictures)
1V1 on Top Layer: 17.8,12.54 18.8,13.54 18.8,13.62 19.83,12.58 20.34,12.58 20.83,13.07 20.98,13.07 21.61,12.44 21.5,12.44 20.73,11.67 20.45,11.67 20.1,12.01 19.46,12.01 18.89,11.44 18.88,11.44 17.8,12.52
1V1 on Top Layer: 20.83,7.5 24.03,10.7 27.23,7.5 24.03,4.29
3V3 on Top Layer: 8.7,15 38.7,15 38.7,0 8.7,0
GND on Top Layer: 23.44,11.31 21.35,13.4 21.32,13.4 21.86,13.94 22.32,13.94 23.07,13.19 23.07,12.07 23.64,11.5 23.45,11.31
GND on Bottom Layer: 8.7,15 38.7,15 38.7,0 8.7,0

## Text on the board
Top Silkscreen Layer: B
